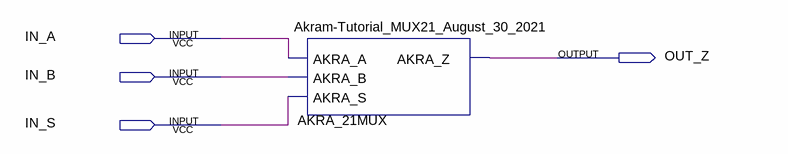
[diagram p0: schematic sheet]
// Quartus schematic Akram_21MUX.bdf as structural Verilog: 1 symbols, 4 pins
module Akram_21MUX (
  input  IN_A,
  input  IN_B,
  input  IN_S,
  output OUT_Z
);

  \Akram-Tutorial_MUX21_August_30_2021  AKRA_21MUX (.AKRA_A(IN_A), .AKRA_B(IN_B), .AKRA_S(IN_S), .AKRA_Z(OUT_Z));
endmodule
